# EasyEDA Pro project Big-Button.eprj

# Board PCB1
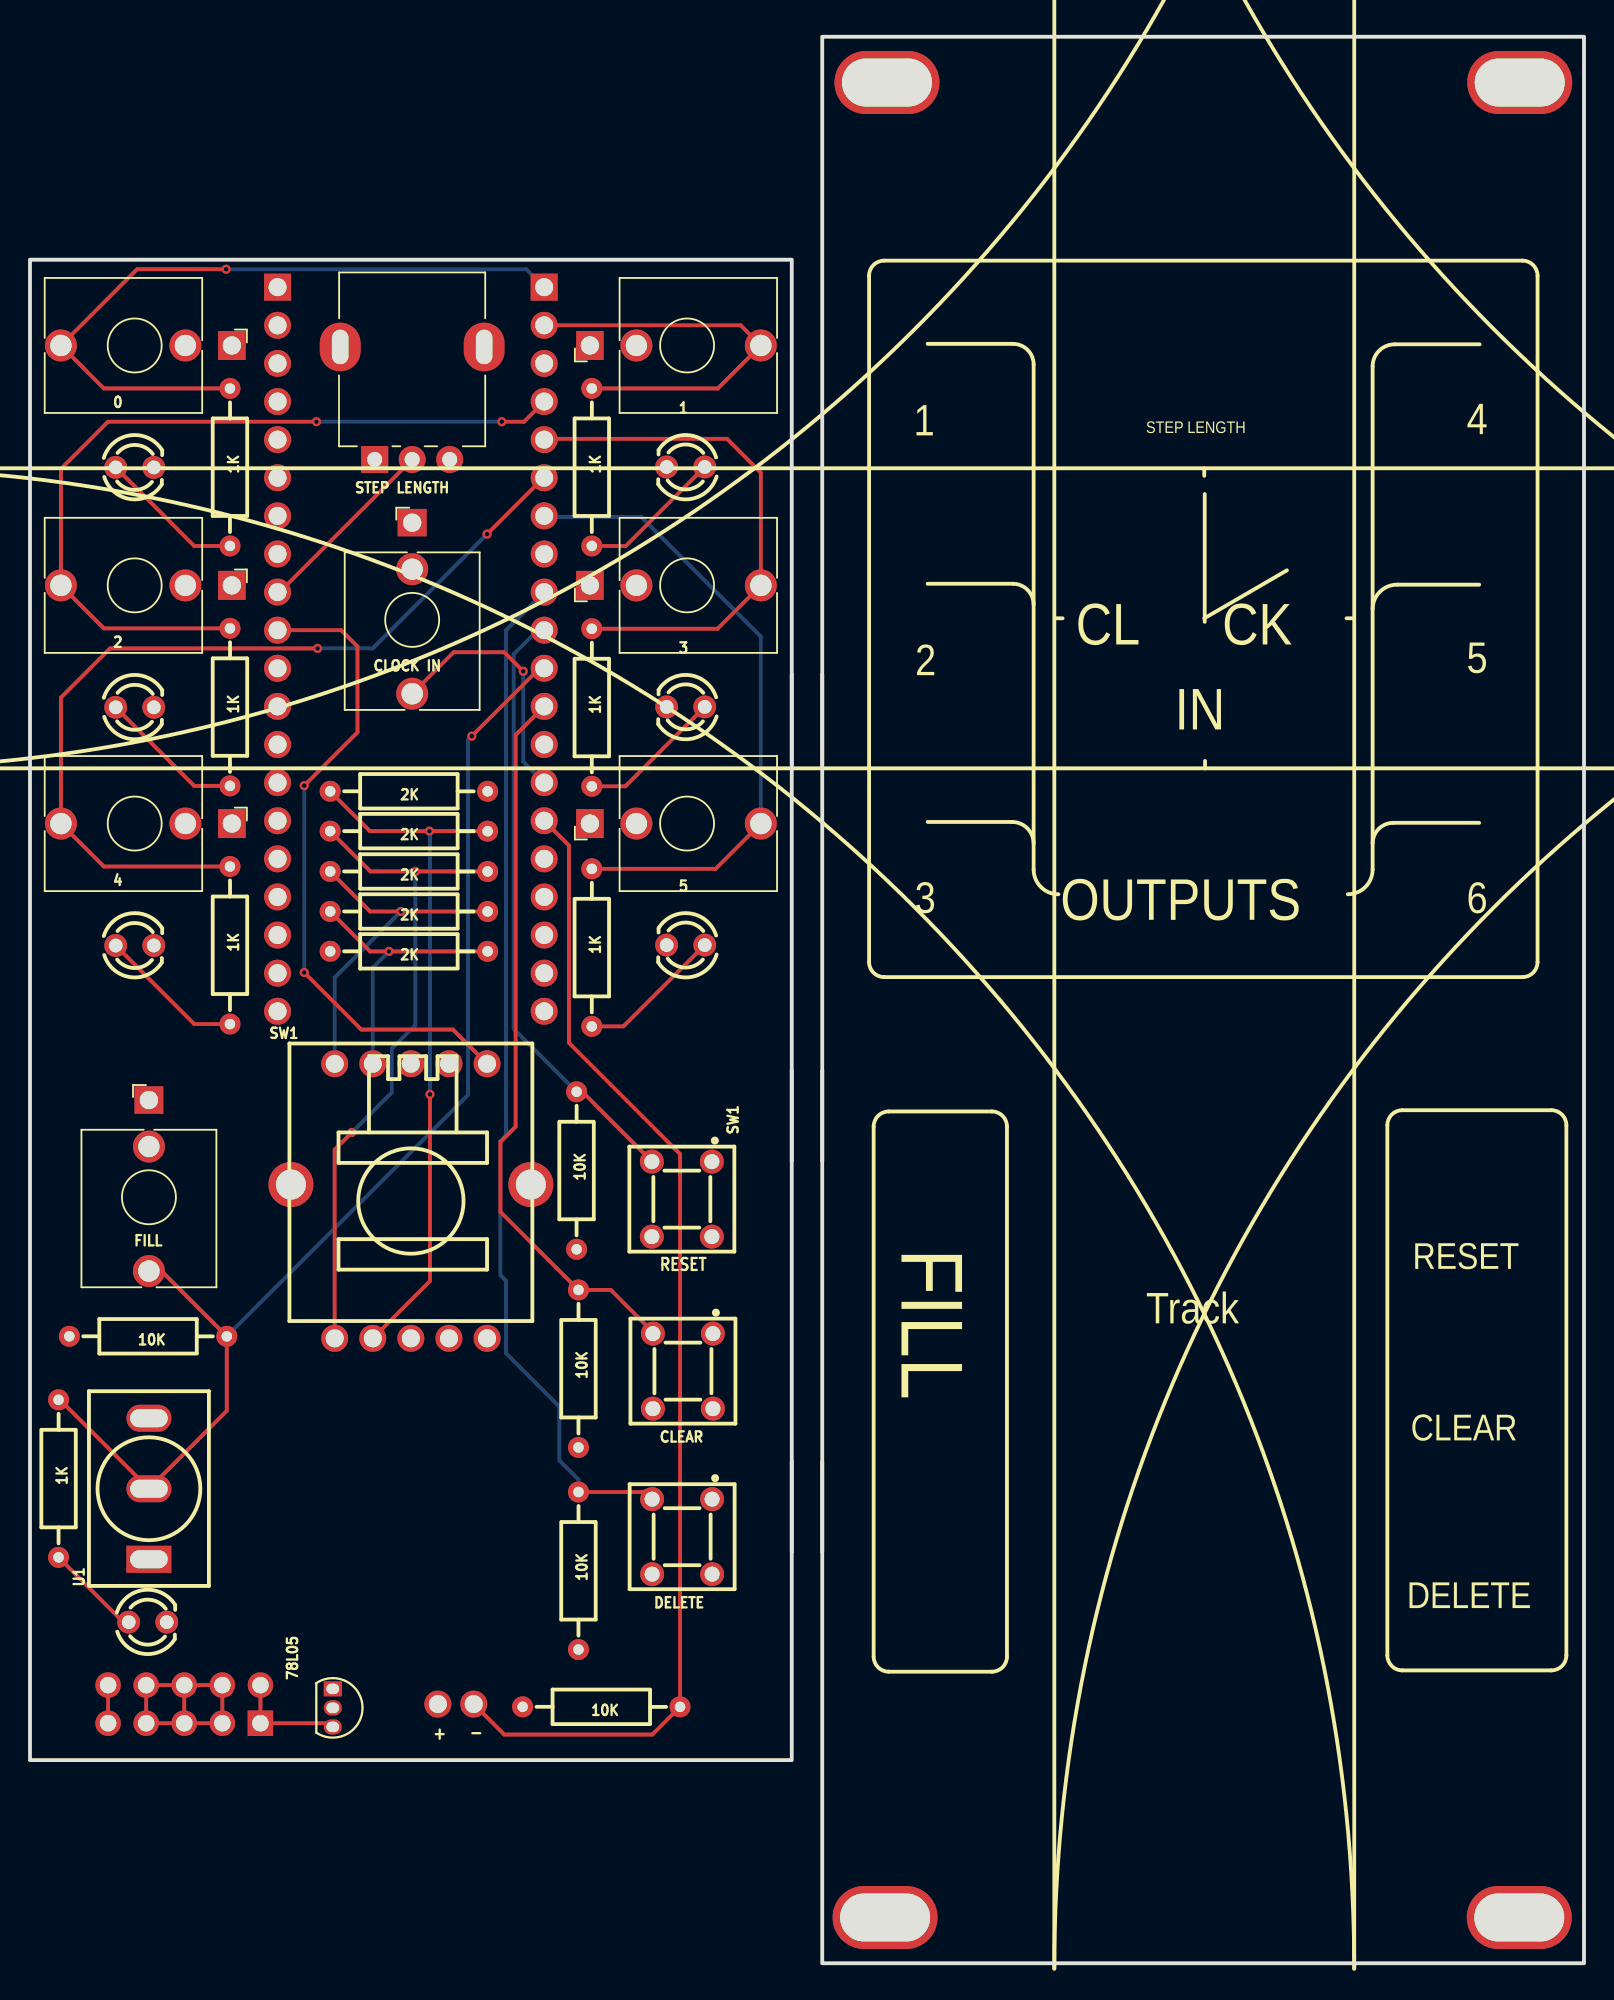
[diagram p0: board, top side]
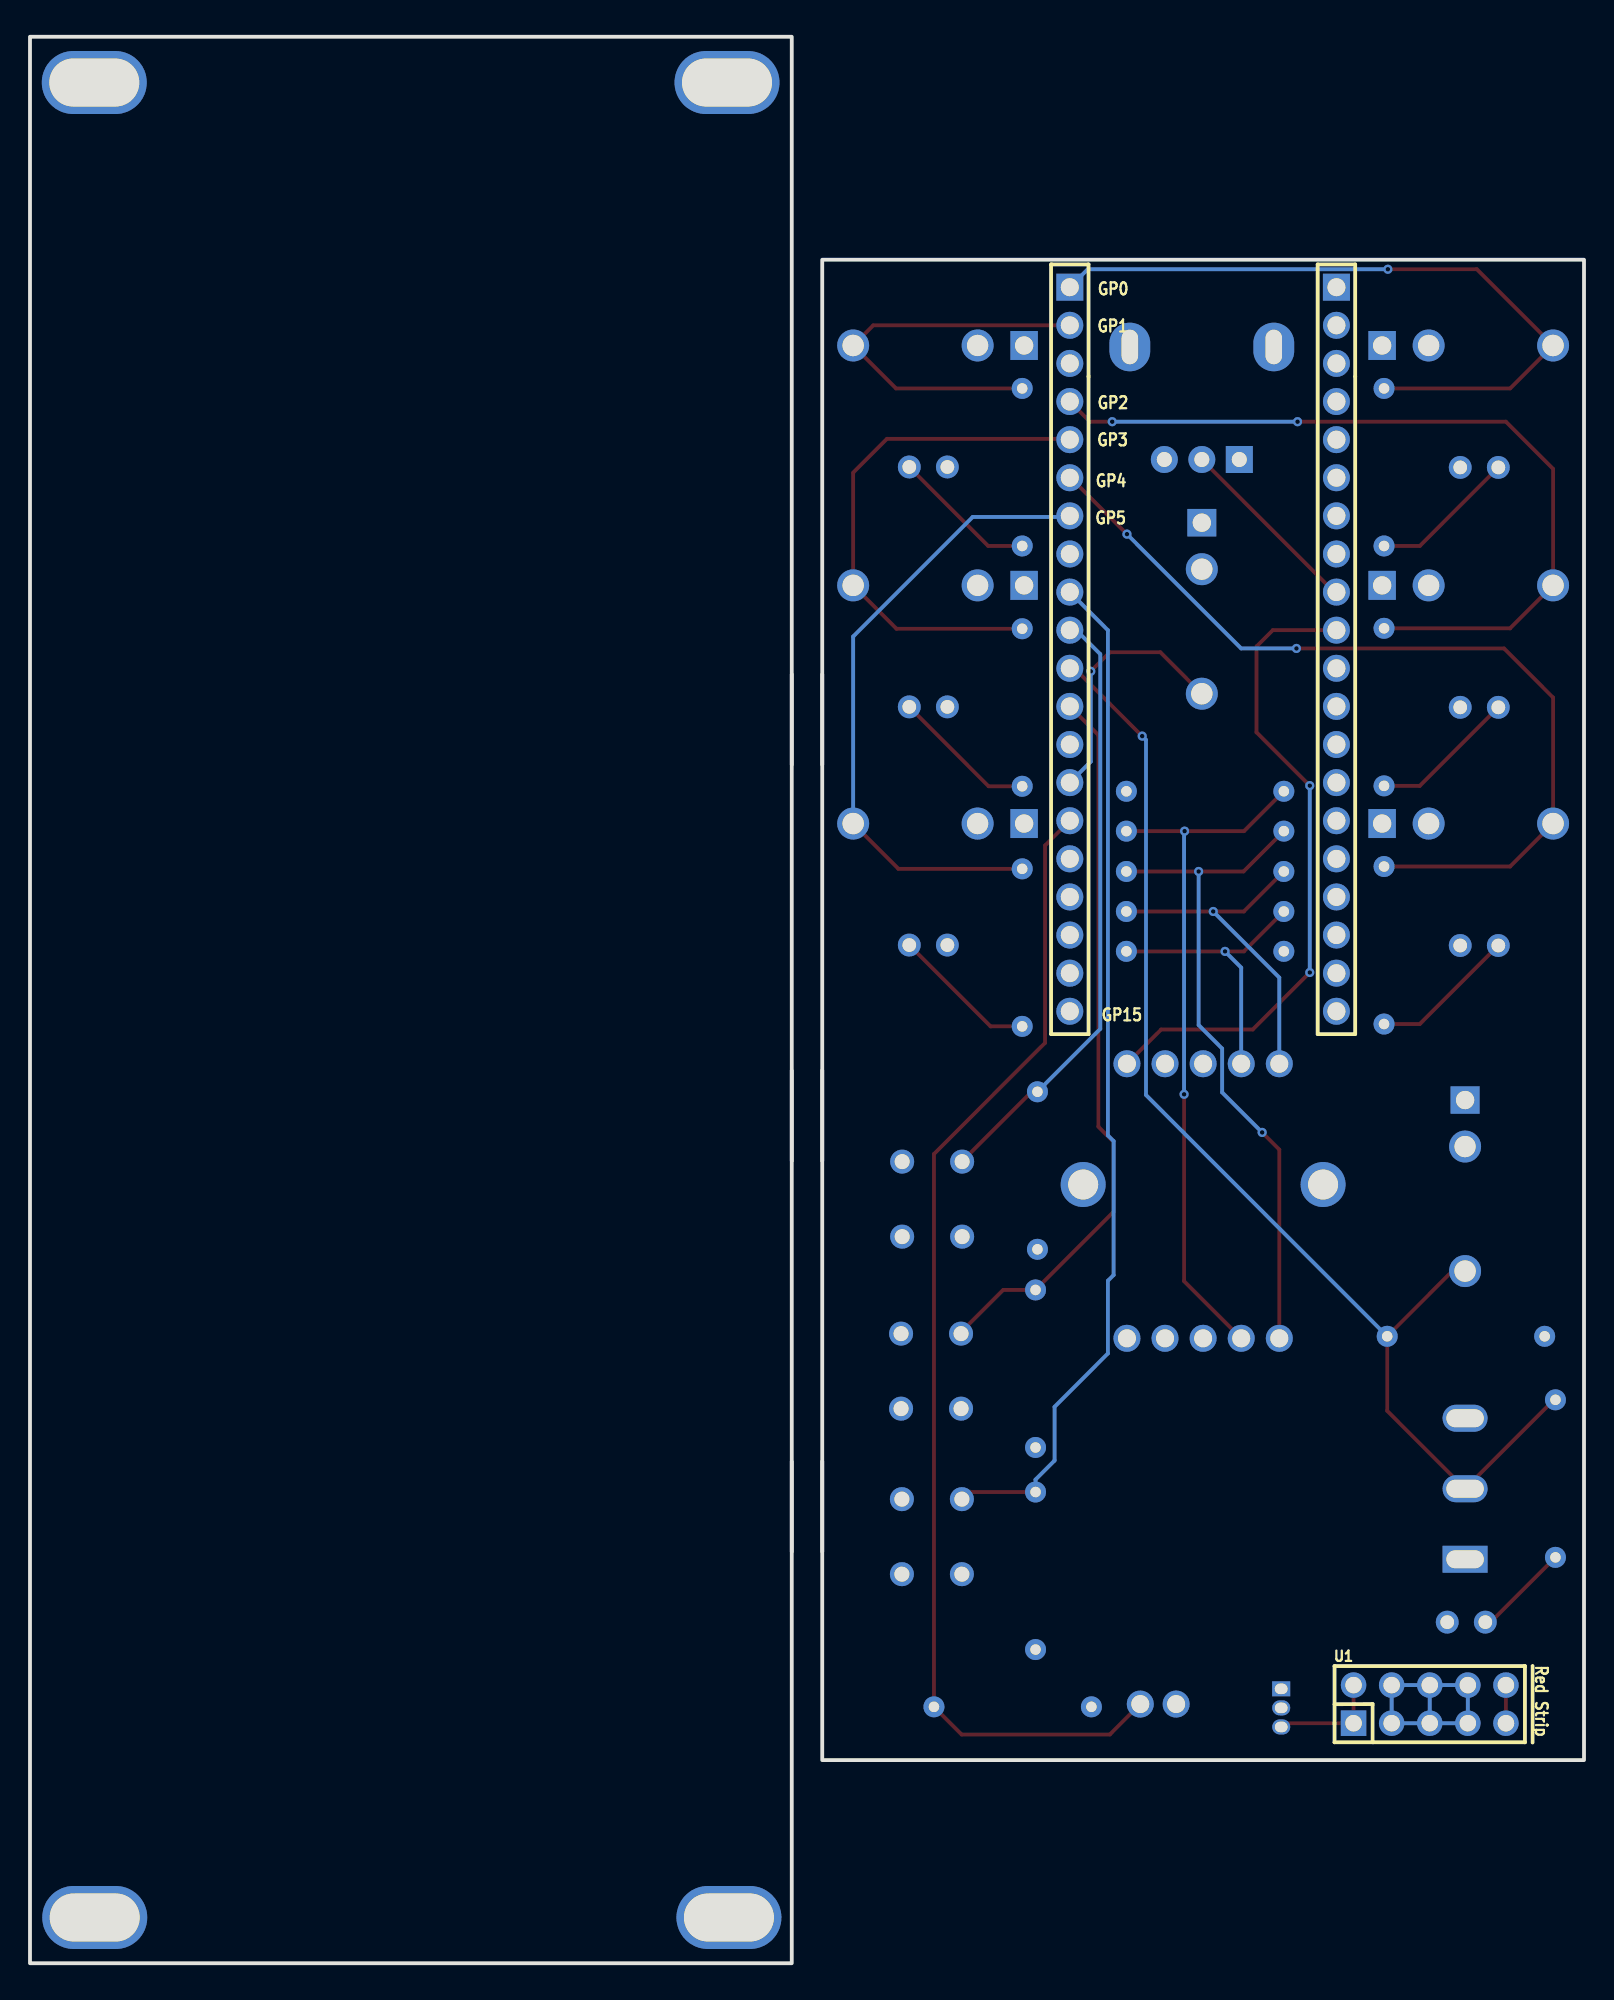
[diagram p1: board, bottom side, seen from below]

Outline 103.63 x 128.4 mm; copper layers: Top Layer, Bottom Layer. Coordinates in mm from the lower left corner of the outline.
Outline path: rectangle 0,113.54 50.8,13.54 ; rectangle 52.83,128.4 103.63,0 ; 50.8,85.92 50.8,79.89 ; 50.8,59.51 50.8,53.47 ; 50.8,33.46 50.8,27.42 ; 52.83,85.9 52.83,79.89 ; 52.83,59.49 52.83,53.47 ; 52.83,33.44 52.83,27.42
Stack: Top Layer 0.035mm / Dielectric1 1.51mm FR4 er 4.5 / Bottom Layer 0.035mm

## Design rules (mm)
template: JLCPCB Capability(Two Layers Board)
spacing copperThickness1oz (default): track to track 0.102, other pairs 0.152 to 0.3
spacing copperThickness2oz: track to track 0.203, other pairs 0.152 to 0.3
track width copperThickness1oz (default): min 0.127, default 0.254, max 2.54
track width copperThickness2oz: min 0.203, default 0.254, max 2.54
differential pair differentialPair (default): width min 0.127, default 0.254, max 2.54; gap min 0.152, default 0.152
via viaSize (default): diameter min 0.5, default 0.61, max 10; hole min 0.3, default 0.305, max 6.3

## Placement (name value [footprint] x y rotation side)
0  -  [benjiaomodular:AudioJack_3.5mm]  13.46 107.82 270 top
1  -  [benjiaomodular:AudioJack_3.5mm]  37.34 107.82 90 top
1K  -  [RES-TH_BD2.3-L6.5-P10.50-D0.5]  13.33 83.72 90 top
1K#2  -  [RES-TH_BD2.3-L6.5-P10.50-D0.5]  13.33 99.71 90 top
1K#3  -  [RES-TH_BD2.3-L6.5-P10.50-D0.5]  37.47 99.71 90 top
1K#4  -  [RES-TH_BD2.3-L6.5-P10.50-D0.5]  37.47 83.69 90 top
1K#5  -  [RES-TH_BD2.3-L6.5-P10.50-D0.5]  13.33 67.85 90 top
1K#6  -  [RES-TH_BD2.3-L6.5-P10.50-D0.5]  37.47 67.69 90 top
1K#7  -  [RES-TH_BD2.3-L6.5-P10.50-D0.5]  1.91 32.3 90 top
2  -  [benjiaomodular:AudioJack_3.5mm]  13.46 91.83 270 top
2K  -  [RES-TH_BD2.3-L6.5-P10.50-D0.5]  25.27 72.77 0 top
2K#2  -  [RES-TH_BD2.3-L6.5-P10.50-D0.5]  25.27 70.1 0 top
2K#3  -  [RES-TH_BD2.3-L6.5-P10.50-D0.5]  25.27 67.44 0 top
2K#4  -  [RES-TH_BD2.3-L6.5-P10.50-D0.5]  25.27 75.45 0 top
2K#5  -  [RES-TH_BD2.3-L6.5-P10.50-D0.5]  25.27 78.11 0 top
3  -  [benjiaomodular:AudioJack_3.5mm]  37.34 91.83 90 top
4  -  [benjiaomodular:AudioJack_3.5mm]  13.46 75.96 270 top
5  -  [benjiaomodular:AudioJack_3.5mm]  37.34 75.96 90 top
10K  -  [RES-TH_BD2.3-L6.5-P10.50-D0.5]  38.1 17.09 0 top
10K#2  -  [RES-TH_BD2.3-L6.5-P10.50-D0.5]  7.87 41.78 0 top
10K#3  -  [RES-TH_BD2.3-L6.5-P10.50-D0.5]  36.45 52.83 90 top
10K#4  -  [RES-TH_BD2.3-L6.5-P10.50-D0.5]  36.58 39.62 90 top
10K#5  -  [RES-TH_BD2.3-L6.5-P10.50-D0.5]  36.58 26.16 90 top
78L05  BC558  [TO-92-3_L4.5-W3.5-P1.27-L]  20.19 17.02 270 top
CLEAR  BTSA-N-P-13  [SW-TH_BTSA-X-P-13]  43.54 39.46 270 top
CLOCK IN  -  [benjiaomodular:AudioJack_3.5mm]  25.49 96.01 0 top
DELETE  BTSA-N-P-13  [SW-TH_BTSA-X-P-13]  43.49 28.43 270 top
FILL  -  [benjiaomodular:AudioJack_3.5mm]  7.93 57.53 0 top
H2  -  [HDR-TH_20P-P2.54-V-F]  34.29 87.58 270 bottom
H2#2  -  [HDR-TH_20P-P2.54-V-F]  16.51 87.58 270 bottom
LED1  -  [LED-TH_BD3.0-P2.54-FD]  43.73 83.74 180 top
LED1#2  -  [LED-TH_BD3.0-P2.54-FD]  6.98 83.71 0 top
LED1#3  -  [LED-TH_BD3.0-P2.54-FD]  43.73 67.86 180 top
LED1#4  -  [LED-TH_BD3.0-P2.54-FD]  6.98 67.83 0 top
LED1#5  -  [LED-TH_BD3.0-P2.54-FD]  6.98 99.7 0 top
LED1#6  -  [LED-TH_BD3.0-P2.54-FD]  43.73 99.73 180 top
LED1#7  -  [LED-TH_BD3.0-P2.54-FD]  7.85 22.73 0 top
NOREF  -  [Pad_e454]  29.59 17.27 270 top
NOREF#2  -  [Pad_e1108]  99.31 3.05 0 top
NOREF#3  -  [Pad_e1098]  99.34 125.35 0 top
NOREF#4  -  [Pad_e1100]  57.02 3.05 0 top
NOREF#5  -  [Pad_e453]  27.2 17.27 270 top
NOREF#6  -  [Pad_e1091]  57.15 125.35 0 top
STEP LENGTH  -  [benjiaomodular:Potentiometer_RV09]  22.99 100.22 90 top
SW1  -  [SW-TH_SRBV151102]  25.4 50.8 0 top
SW1#2  -  [SW-TH_BTSA-X-P-13]  43.47 50.93 270 top
U1  -  [SW-TH_MT-0-103-A101-M200-RS]  7.93 31.62 90 top
U1#2  -  [HDR-TH_10P-P2.54-V-M-R2-C5-S2.54]  10.29 17.27 180 bottom

## Footprints (pads in the part's own frame, mm; a bottom-side part is the same pattern mirrored in y, then rotated)
benjiaomodular:AudioJack_3.5mm
  rect 1.93x1.83 hole 1.22: S(0,0)
  round 2.13 hole 1.43: T(0,-11.4)
  round 2.13 hole 1.42: TN(0,-3.1)
benjiaomodular:Potentiometer_RV09
  rect 1.8x1.8 hole 1: 1(0,0)
  round 1.8 hole 1: 2(0,-2.5) 3(0,-5)
  oval 3.24x2.72 hole 2.3x1.1: 4(7.5,-7.3) 5(7.5,2.3)
HDR-TH_10P-P2.54-V-M-R2-C5-S2.54
  rect 1.7x1.7 hole 1.1: 1(-5.08,-1.27)
  round 1.7 hole 1.1: 2(-5.08,1.27) 3(-2.54,-1.27) 4(-2.54,1.27) 5(0,-1.27) 6(0,1.27) 7(2.54,-1.27) 8(2.54,1.27) 9(5.08,-1.27) 10(5.08,1.27)
HDR-TH_20P-P2.54-V-F
  rect 1.8x1.8 hole 1.2: 1(-24.13,0)
  round 1.8 hole 1.2: 2(-21.59,0) 3(-19.05,0) 4(-16.51,0) 5(-13.97,0) 6(-11.43,0) 7(-8.89,0) 8(-6.35,0) 9(-3.81,0) 10(-1.27,0) 11(1.27,0) 12(3.81,0) 13(6.35,0) 14(8.89,0) 15(11.43,0) 16(13.97,0) 17(16.51,0) 18(19.05,0) 19(21.59,0) 20(24.13,0)
LED-TH_BD3.0-P2.54-FD
  round 1.524 hole 0.914: 1(-1.27,0) 2(1.27,0)
Pad_e453
  round 1.8 hole 1.2: 3(0,0)
Pad_e454
  round 1.8 hole 1.2: 4(0,0)
Pad_e1091
  oval 7x4.2 hole 6x3.2: 17(0,0)
Pad_e1098
  oval 7x4.2 hole 6x3.2: 17(0,0)
Pad_e1100
  oval 7x4.2 hole 6x3.2: 17(0,0)
Pad_e1108
  oval 7x4.2 hole 6x3.2: 17(0,0)
RES-TH_BD2.3-L6.5-P10.50-D0.5
  round 1.4 hole 0.7: 1(-5.25,0) 2(5.25,0)
SW-TH_BTSA-X-P-13
  round 1.6 hole 1: 1(-2.5,2) 2(-2.5,-2) 3(2.5,2) 4(2.5,-2)
SW-TH_MT-0-103-A101-M200-RS
  rect 1.8x3 hole 1.2x2.5: 1(-4.7,0)
  oval 1.8x3 hole 1.2x2.5: 2(0,0) 3(4.7,0)
SW-TH_SRBV151102
  round 1.8 hole 1.2: 1(5.08,-9.15) 2(2.54,-9.15) 3(0,-9.15) 4(-2.54,-9.15) 5(-5.08,-9.15) 6(-5.08,9.15) 7(-2.54,9.15) 8(0,9.15) 9(2.54,9.15) 10(5.08,9.15)
  round 3 hole 2: 11(8,1.1) 12(-8,1.1)
TO-92-3_L4.5-W3.5-P1.27-L
  rect 1x1.2 hole 0.7x0.85: 1(-1.27,0)
  oval 1x1.2 hole 0.7x0.85: 2(0,0) 3(1.27,0)

## Nets
GND: 0.S 1.S 2.S 2K#5.2 3.S 4.S 5.S 10K.1 10K#2.1 10K#3.1 10K#4.1 10K#5.1 78L05.2 CLOCK IN.S FILL.S H2.3 H2.8 H2.13 H2.18 H2#2.3 H2#2.8 H2#2.13 H2#2.18 LED1.2 LED1#2.2 LED1#3.2 LED1#4.2 LED1#5.2 LED1#6.2 LED1#7.2 STEP LENGTH.3 SW1.3 U1#2.3 U1#2.4 U1#2.5 U1#2.6 U1#2.7 U1#2.8
4: 2K#4.2 2K#5.1 SW1.4
5: 2K.2 2K#4.1 SW1.5
6: 2K.1 2K#2.2 SW1.6
7: 2K#2.1 2K#3.2 SW1.7
+5: 2K#3.1 78L05.1 CLEAR.1 DELETE.1 NOREF#5.3 STEP LENGTH.1 SW1.8 SW1#2.1 U1.3
+12: 78L05.3 U1#2.1 U1#2.2
-12: U1#2.9 U1#2.10
GP0: 0.T 1K#2.2 H2.1
GP1: 1.T 1K#3.2 H2.2
GP2: 1K.2 2.T H2.4
GP3: 1K#4.2 3.T H2.5
GP4: 1K#5.2 4.T H2.6
GP5: 1K#6.2 5.T H2.7
GP6: 10K#5.2 DELETE.2 H2.9
GP7: 10K#3.2 H2.10 SW1#2.2
GP8: 1K#7.2 10K#2.2 FILL.T H2.11 U1.2
GP9: 10K#4.2 CLEAR.2 H2.12
GP10: CLOCK IN.T H2.14
GP11: 10K.2 H2.15 NOREF.4
GP26: H2#2.10 SW1.10
GP27: H2#2.9 STEP LENGTH.2

Pads without a net: 0 TN; 1 TN; 1K 1; 1K#2 1; 1K#3 1; 1K#4 1; 1K#5 1; 1K#6 1; 1K#7 1; 2 TN; 3 TN; 4 TN; 5 TN; CLEAR 3 4; CLOCK IN TN; DELETE 3 4; FILL TN; H2 16 17 19 20; H2#2 1 2 4 5 6 7 11 12 14 15 16 17 19 20; LED1 1; LED1#2 1; LED1#3 1; LED1#4 1; LED1#5 1; LED1#6 1; LED1#7 1; NOREF#2 17; NOREF#3 17; NOREF#4 17; NOREF#6 17; STEP LENGTH 4 5; SW1 1 2 9 11 12; SW1#2 3 4; U1 1

## Via types
v1: diameter 0.61, hole 0.305, Top Layer to Bottom Layer, 15 vias

## Routing (per net, layer and track width the routed paths; a pad name or vN(x,y) marks a point on that pad's centre or on a via; arc(x,y) is an arc through that point)
GND: length 35.6
  Top Layer w0.254: U1#2.6 U1#2.5 ; U1#2.6 U1#2.8 U1#2.7 U1#2.5 ; U1#2.6 U1#2.4 U1#2.3 U1#2.5
  Bottom Layer w0.254: U1#2.6 U1#2.8 U1#2.7 U1#2.5 ; U1#2.6 U1#2.4 U1#2.3 U1#2.5 ; U1#2.6 U1#2.5
(no net): length 65
  Top Layer w0.254: LED1.1 39.7,78.44 1K#4.1 ; 1K#5.1 10.95,62.6 LED1#4.1 ; 1K#6.1 39.58,62.44 LED1#3.1 ; 1K#2.1 10.95,94.46 LED1#5.1 ; LED1#6.1 39.73,94.46 1K#3.1 ; 1K#7.1 6.22,22.73 LED1#7.1 ; 1K.1 10.95,78.47 LED1#2.1
4: length 47
  Top Layer w0.254: SW1.4 26.67,45.46 v1(26.67,57.91) ; 2K#4.2 v1(26.64,75.45) 22.67,75.45 2K#5.1
  Bottom Layer w0.254: v1(26.67,57.91) 26.67,75.42 v1(26.64,75.45)
5: length 45
  Top Layer w0.254: v1(21.46,55.37) 20.32,54.23 SW1.5 ; 2K.2 v1(25.7,72.77) 22.71,72.77 2K#4.1
  Bottom Layer w0.254: v1(25.7,72.77) 25.7,62.53 24.13,60.96 24.13,58.04 v1(21.46,55.37)
6: length 23.6
  Top Layer w0.254: 2K#2.2 v1(24.73,70.1) 22.68,70.1 2K.1
  Bottom Layer w0.254: SW1.6 20.32,65.69 v1(24.73,70.1)
7: length 19.5
  Top Layer w0.254: 2K#3.2 30.51,67.44 v1(23.94,67.44) 22.68,67.44 2K#2.1
  Bottom Layer w0.254: SW1.7 22.86,66.36 v1(23.94,67.44)
+12: length 7.5
  Top Layer w0.254: 78L05.3 19.94,16 U1#2.1 U1#2.2
-12: length 2.5
  Top Layer w0.254: U1#2.9 U1#2.10
GP0: length 47.3
  Top Layer w0.254: 1K#2.2 4.92,104.96 0.T 7.14,112.9 v1(13.08,112.9)
  Bottom Layer w0.254: v1(13.08,112.9) 33.09,112.9 H2.1
GP1: length 27.5
  Top Layer w0.254: 1K#3.2 45.88,104.96 1.T 47.39,109.17 H2.2
GP2: length 54.3
  Top Layer w0.254: 1K.2 4.92,88.97 2.T 2.06,99.6 5.21,102.74 v1(19.1,102.74) ; H2.4 32.95,102.74 v1(31.46,102.74)
  Bottom Layer w0.254: v1(31.46,102.74) v1(19.1,102.74)
GP3: length 35.4
  Top Layer w0.254: 1K#4.2 45.85,88.94 3.T 48.74,99.34 46.48,101.6 34.34,101.6 H2.5
GP4: length 59.2
  Top Layer w0.254: v1(19.18,87.63) 5.33,87.63 2.06,84.36 4.T 4.92,73.1 1K#5.2 ; H2.6 34.24,99.01 v1(30.48,95.25)
  Bottom Layer w0.254: v1(19.18,87.63) 22.86,87.63 v1(30.48,95.25)
GP5: length 42.8
  Top Layer w0.254: 5.T 45.72,72.94 1K#6.2
  Bottom Layer w0.254: H2.7 34.36,96.39 40.77,96.39 48.74,88.42 5.T
GP6: length 68.5
  Top Layer w0.254: 40.99,31.45 40.99,31.41 ; 40.99,31.41 41.01,31.41 DELETE.2 ; 40.99,31.41 10K#5.2
  Bottom Layer w0.254: H2.9 31.75,88.85 31.75,55.18 31.37,54.8 31.37,45.87 31.75,45.49 31.75,40.64 35.31,37.08 35.31,33.5 36.58,32.23 10K#5.2
GP7: length 40.6
  Top Layer w0.254: SW1#2.2 41.47,53.45 36.83,58.08 10K#3.2
  Bottom Layer w0.254: 10K#3.2 32.26,62.27 32.26,87.25 33.86,88.85 H2.10
GP8: length 81.3
  Top Layer w0.254: H2.11 33.98,86.31 v1(29.46,81.79) ; 1K#7.2 2,37.55 U1.2 13.12,36.82 10K#2.2 8.78,46.13 FILL.T
  Bottom Layer w0.254: v1(29.46,81.79) 29.21,81.53 29.21,57.87 10K#2.2
GP9: length 48.5
  Top Layer w0.254: CLEAR.2 41.54,42.06 38.73,44.87 10K#4.2 31.37,50.08 31.37,54.74 32.38,55.75 32.38,81.86 H2.12
GP10: length 17.1
  Top Layer w0.254: CLOCK IN.T 28.25,87.38 31.62,87.38 v1(32.89,86.11)
  Bottom Layer w0.254: v1(32.89,86.11) 32.89,80.08 H2.14
GP11: length 78.2
  Top Layer w0.254: NOREF.4 31.62,15.24 41.5,15.24 10K.2 43.35,53.93 35.94,61.34 35.94,74.5 34.29,76.15
GP26: length 43.7
  Top Layer w0.254: SW1.10 28.2,62.23 22.09,62.23 v1(18.29,66.03) ; v1(18.29,78.49) 21.84,82.04 21.84,87.76 20.75,88.85 H2#2.10
  Bottom Layer w0.254: v1(18.29,66.03) v1(18.29,78.49)
GP27: length 12.6
  Top Layer w0.254: STEP LENGTH.2 16.65,91.39 H2#2.9

## Copper pours and planes (outline as drawn; the poured copper is in the pictures)
GND on Top Layer: -0.95,114.43 50.57,114.43 50.57,12.95 -0.95,12.95
+5 on Bottom Layer: -0.96,114.35 50.57,114.35 50.57,12.42 -0.96,12.42

## Text on the board
Bottom Silkscreen Layer: Red Strip | GP15 | GP0 | GP2 | GP1 | GP3 | GP4 | GP5
Top Silkscreen Layer: + | - | RESET | STEP LENGTH | DELETE | CLEAR | 1 | 3 | 2 | 4 | 5 | 6 | Track | OUTPUTS | CL      CK | IN | FILL
